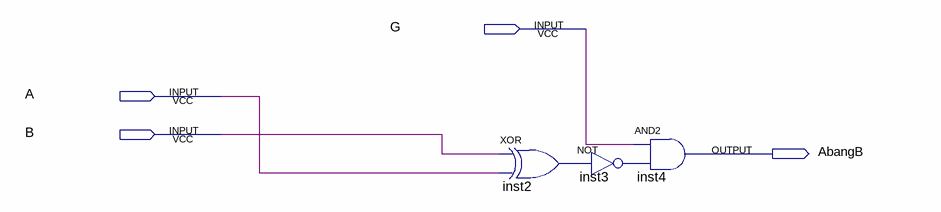
[diagram p0: schematic sheet]
// Quartus schematic SoSanhBang1Bit.bdf as structural Verilog: 3 symbols, 4 pins
module SoSanhBang1Bit (
  input  G,
  input  A,
  input  B,
  output AbangB
);

  wire inst2_out, inst3_out;

  xor inst2 (inst2_out, B, A);
  not inst3 (inst3_out, inst2_out);
  and inst4 (AbangB, G, inst3_out);
endmodule
